# EAGLE design SparkX_EZ_Power_AAA (EAGLE 9.6.2)
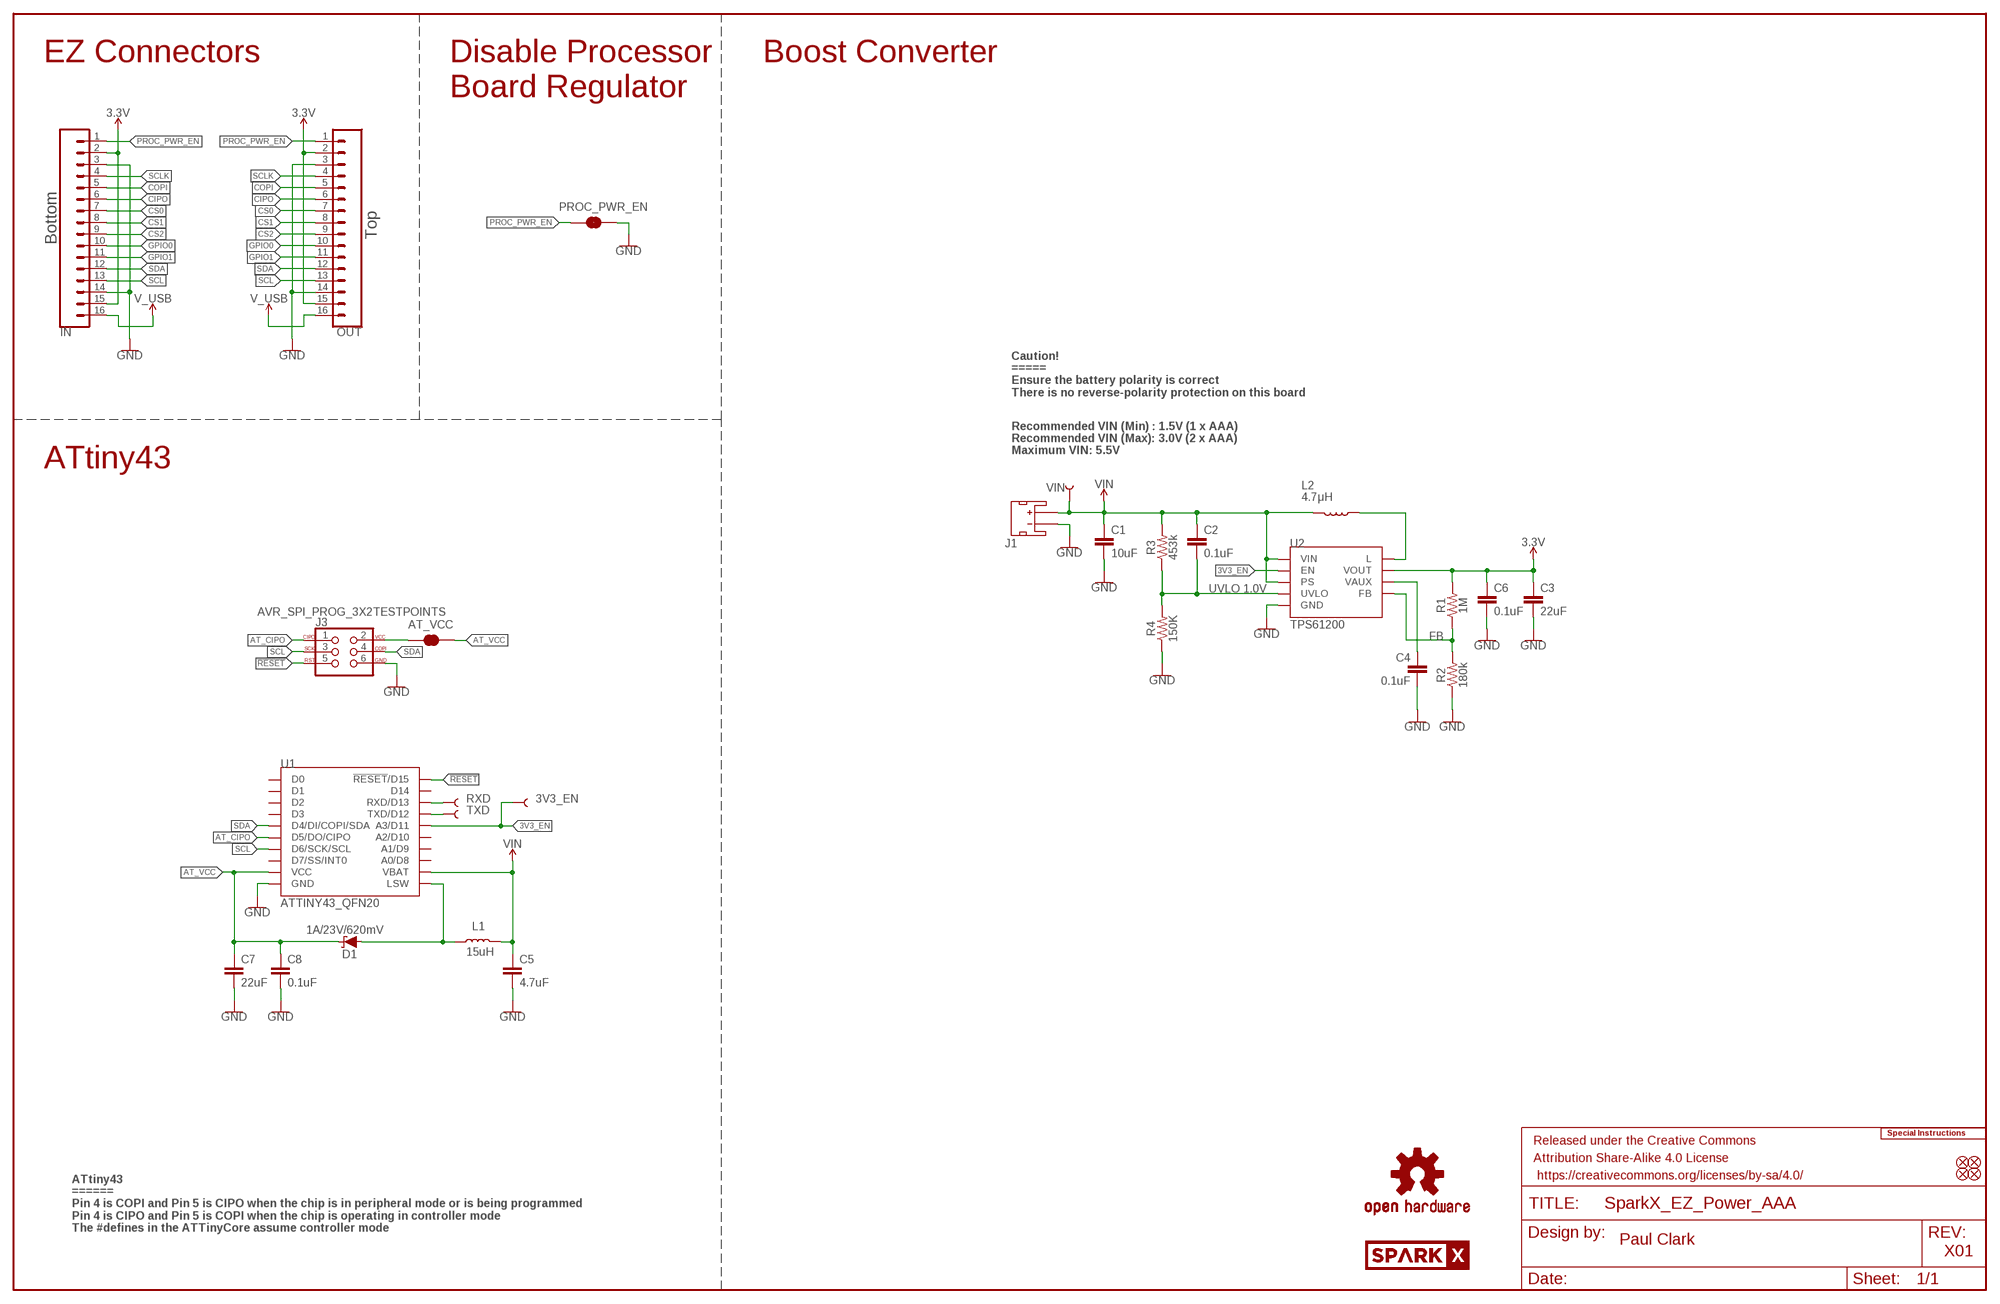
[diagram p0: schematic, sheet 1]

## Parts
3V3_EN  TEST-POINT3X4  [PAD.03X.04]
AT_VCC  JUMPER-SMT_2_NC_TRACE_SILK  [SMT-JUMPER_2_NC_TRACE_SILK]
C1  10uF  10UF-0402T-6.3V-20%  [0402-TIGHT]
C2  0.1uF  0.1UF-0402T-6.3V-10%-X7R  [0402-TIGHT]
C3  22uF  22UF-0603-6.3V-20%  [0603]
C4  0.1uF  0.1UF-0402T-6.3V-10%-X7R  [0402-TIGHT]
C5  4.7uF  4.7UF-0402_TIGHT-6.3V-20%-X5R  [0402-TIGHT]
C6  0.1uF  0.1UF-0402T-6.3V-10%-X7R  [0402-TIGHT]
C7  22uF  22UF-0603-6.3V-20%  [0603]
C8  0.1uF  0.1UF-0402T-6.3V-10%-X7R  [0402-TIGHT]
D1  1A/23V/620mV  DIODE-SCHOTTKY-BAT20J  [SOD-323]
FD1  FIDUCIALUFIDUCIAL  [FIDUCIAL-MICRO]
FD2  FIDUCIALUFIDUCIAL  [FIDUCIAL-MICRO]
FD3  FIDUCIALUFIDUCIAL  [FIDUCIAL-MICRO]
FD4  FIDUCIALUFIDUCIAL  [FIDUCIAL-MICRO]
FRAME1  FRAME-LEDGER  [CREATIVE_COMMONS]
IN  CONN_16FPC_16_0.5MM  [FPC_16_0.5MM]
J1  JST_2MM_MALE  [JST-2-SMD]
J3  AVR_SPI_PROG_3X2TESTPOINTS  [2X3_TEST_POINTS]
L1  15uH  INDUCTOR-LHQ32-15UH  [INDUCTOR_LQH32]
L2  4.7μH  4.7μH_SHIELDED_INDUCTORNPIS_LS  [INDUCTOR_4X4MM]
LOGO1  SPECIAL_INSTRUCTIONS-ORDERING  [ORDERING_INSTRUCTIONS]
LOGO2  OSHW-LOGOMINI  [OSHW-LOGO-MINI]
LOGO3  OSHW-LOGOMINI  [OSHW-LOGO-MINI]
OUT  CONN_16FPC_16_0.5MM  [FPC_16_0.5MM]
PROC_PWR_EN  JUMPER-SMT_2_NC_TRACE_SILK  [SMT-JUMPER_2_NC_TRACE_SILK]
R1  1M  1MOHM-0402T-1/16W-5%  [0402-TIGHT]
R2  180k  180KOHM-0402T-1/16W-1%  [0402-TIGHT]
R3  453k  453KOHM-0402T-1/16W-1%  [0402-TIGHT]
R4  150K  150KOHM-0402T-1/16W-1%  [0402-TIGHT]
RXD  TEST-POINT3X4  [PAD.03X.04]
TXD  TEST-POINT3X4  [PAD.03X.04]
U1  ATTINY43_QFN20  [QFN20_20M1]
U2  TPS61200  TPS61200_MINIMAL  [QFN-10_PAD]
U$1  SPARKX-LOGO3  [SPARKX-SMALL]
VIN  TEST-POINT3X4  [PAD.03X.04]

## Nets
3.3V: C3.1 C6.1 IN.2 IN.15 OUT.2 OUT.15 R1.2 U2.2(VOUT)
3V3_EN: 3V3_EN.1 U1.14(A3/D11) U2.6(EN)
!RESET!: J3.5 U1.18(!RESET!/D15)
AT_CIPO: J3.1 U1.4(D5/DO/CIPO)
AT_VCC: AT_VCC.2 C7.1 C8.1 D1.C U1.7(VCC)
CIPO: IN.6 OUT.6
COPI: IN.5 OUT.5
CS0: IN.7 OUT.7
CS1: IN.8 OUT.8
CS2: IN.9 OUT.9
FB: R1.1 R2.2 U2.10(FB)
GND: C1.2 C3.2 C4.2 C5.2 C6.2 C7.2 C8.2 IN.3 IN.14 J1.1(-) J3.6 OUT.3 OUT.14 PROC_PWR_EN.2 R2.1 R4.1 U1.8(GND) U1.PAD(GND) U2.4(GND) U2.9(GND) U2.11(GND) U2.12(GND) U2.13(GND) U2.14(GND) U2.15(GND)
GPIO0: IN.10 OUT.10
GPIO1: IN.11 OUT.11
N$1: L2.P$1 U2.3(L)
N$2: D1.A L1.P$1 U1.9(LSW)
N$3: AT_VCC.1 J3.2
N$4: C4.1 U2.1(VAUX)
PROC_PWR_EN: IN.1 OUT.1 PROC_PWR_EN.1
RXD: RXD.1 U1.16(RXD/D13)
SCL: IN.13 J3.3 OUT.13 U1.5(D6/SCK/SCL)
SCLK: IN.4 OUT.4
SDA: IN.12 J3.4 OUT.12 U1.3(D4/DI/COPI/SDA)
TXD: TXD.1 U1.15(TXD/D12)
UVLO: C2.2 R3.1 R4.2 U2.7(UVLO)
V_USB: IN.16 OUT.16
VIN: C1.1 C2.1 C5.1 J1.2(+) L1.P$2 L2.P$2 R3.2 U1.10(VBAT) U2.5(VIN) U2.8(PS) VIN.1
Unconnected: J1.NC1(PAD1) J1.NC2(PAD2) U1.1(D2) U1.2(D3) U1.6(D7/SS/INT0) U1.11(A0/D8) U1.12(A1/D9) U1.13(A2/D10) U1.17(D14) U1.19(D0) U1.20(D1)

## Notes on the sheet
- EZ Connectors | Boost Converter
- Disable Processor
  Board Regulator
- Top
- Bottom
- Caution!
  =====
  Ensure the battery polarity is correct
  There is no reverse-polarity protection on this board
- Recommended VIN (Min) : 1.5V (1 x AAA)
  Recommended VIN (Max): 3.0V (2 x AAA)
  Maximum VIN: 5.5V
- ATtiny43
- UVLO 1.0V
- ATtiny43
  ======
  Pin 4 is COPI and Pin 5 is CIPO when the chip is in peripheral mode or is being programmed
  Pin 4 is CIPO and Pin 5 is COPI when the chip is operating in controller mode
  The #defines in the ATTinyCore assume controller mode
- Paul Clark
- X01

## Library data of the parts
3V3_EN RXD TXD VIN = SparkFun-Connectors:TEST-POINT: SparkFun Test Points Bare copper test points for troubleshooting or In-Circuit-Testing. These are used by our Production team for verifying production board runs using pogo-pins on test beds. SparkFun Products: SparkFun LSM9DS1 Breakout <https://www.sparkfun.com/products/13284> SparkFun PSOC <https://www.sparkfun.com/products/13714> SparkFun Load Cell Amplifier <https://www.sparkfun.com/products/13879>
AT_VCC PROC_PWR_EN = SparkFun-Jumpers:JUMPER-SMT_2_NC_TRACE: Normally closed trace jumper This jumper has a trace between two pads so it's normally closed (NC). Use a razor knife to open the connection. For best results follow the IPC guidelines for cutting traces: Cutout at least 0.063 mm (0.005 in). Remove all loose material to clean up the cut area. Seal the cut with an approved epoxy. Reapply solder to reclose the connection.
C1 = SparkFun-Capacitors:10UF: 10.0µF ceramic capacitors A capacitor is a passive two-terminal electrical component used to store electrical energy temporarily in an electric field.; PROD_ID: CAP-14848
C2 C4 C6 C8 = SparkFun-Capacitors:0.1UF: 0.1µF ceramic capacitors A capacitor is a passive two-terminal electrical component used to store electrical energy temporarily in an electric field.; PROD_ID: CAP-14993
C3 C7 = SparkFun-Capacitors:22UF: 22µF ceramic capacitors A capacitor is a passive two-terminal electrical component used to store electrical energy temporarily in an electric field.; PROD_ID: CAP-14464
C5 = SparkFun-Capacitors:4.7UF: 4.7µF ceramic capacitors A capacitor is a passive two-terminal electrical component used to store electrical energy temporarily in an electric field.; PROD_ID: CAP-14240
D1 = SparkFun-DiscreteSemi:DIODE-SCHOTTKY: Schottky diode A Schottky diode is a semiconductor diode which has a low forward voltage drop and a very fast switching action.; PROD_ID: DIO-11623
FD1-FD4 = SparkFun-Aesthetics:FIDUCIAL: Fiducial Alignment Points Point-of-reference for pick-and-place machines and other optical instruments.
FRAME1 = SparkFun-Aesthetics:FRAME-LEDGER: Schematic Frame - Ledger Standard 11x14 US Ledger frame
IN OUT = SparkFun-Connectors:CONN_16: Multi connection point. Often used as Generic Header-pin footprint for 0.1 inch spaced/style header connections On any of the 0.1 inch spaced packages, you can populate with these: Break Away Headers - Straight <https://www.sparkfun.com/products/116> (PRT-00116) Break Away Male Headers - Right Angle <https://www.sparkfun.com/products/553> (PRT-00553) Female Headers <https://www.sparkfun.com/products/115> (PRT-00115) Break Away Headers - Machine Pin <https://www.sparkfun.com/products/117> (PRT-00117) Break Away Female Headers - Swiss Machine Pin <https://www.sparkfun.com/products/743> (PRT-00743) For SCREWTERMINALS and SPRING TERMINALS visit here: Screw Terimnals on SparkFun.com <https://www.sparkfun.com/search/results?term=Screw+Terminals> (5mm/3.5mm/2.54mm spacing) This device is also useful as a general connection point to wire up your design to another part of your project. Our various solder wires solder well into these plated through hole pads. Hook-Up Wire - Assortment (Stranded, 22 AWG) <https://www.sparkfun.com/products/11375> (PRT-11375) Hook-Up Wire - Assortment (Solid Core, 22 AWG) <https://www.sparkfun.com/products/11367> (PRT-11367) View the entire wire category on our website here <https://www.sparkfun.com/categories/141> Special notes: Molex polarized connector foot print use with SKU : PRT-08231 with associated crimp pins and housings. 1MM SMD Version SKU: PRT-10208 NOTES ON THE VARIANTS LOCK and LOCK_LONGPADS... This footprint was designed to help hold the alignment of a through-hole component (i.e. 6-pin header) while soldering it into place. You may notice that each hole has been shifted either up or down by 0.005 of an inch from it's more standard position (which is a perfectly straight line). This slight alteration caused the pins (the squares in the middle) to touch the edges of the holes. Because they are alternating, it causes a "brace" to hold the component in place. 0.005 has proven to be the perfect amount of "off-center" position when using our standard breakaway headers. Although looks a little odd when you look at the bare footprint, once you have a header in there, the alteration is very hard to notice. Also,if you push a header all the way into place, it is covered up entirely on the bottom side.; PROD_ID: CONN-16066
J1 = SparkFun-Connectors:JST_2MM_MALE: JST 2MM MALE RA CONNECTOR Two pin, compact surface mount connector. Commonly used as a battery input connection point. We really like the solid locking feeling and high current rating on these small connectors. We use these all the time as battery connectors. Mates to single-cell LiPo batteries. Here is the connector we sell at SparkFun: JST Right Angle Connector - White <https://www.sparkfun.com/products/8612> (PRT-08612) Datasheet <http://www.sparkfun.com/datasheets/Prototyping/Connectors/JST-Horizontal.pdf> It was used on these SparkFun products: SparkFun MOSFET Power Controller <https://www.sparkfun.com/products/11214> (PRT-11214) SparkFun Battery Babysitter - LiPo Battery Manager <https://www.sparkfun.com/products/13777> (PRT-13777) And many, many others that required a lipo battery connection.; PROD_ID: CONN-11443; SF_ID: PRT-08612
J3 = SparkFun-Connectors:AVR_SPI_PROG_3X2: AVR ISP 6 Pin This is the reduced ISP connector for AVR programming. Common on Arduino. This footprint will take up less PCB space and can be used with a 10-pin to 6-pin adapter such as SKU: BOB-08508 **Special note about "TEST_POINT" package. The stop mask is on the top side, so if you want your programming test points to be on the bottom of your board, make sure to place this package on the bottom side of the board. This also ensure that the orientation to program from the bottom side will be correct. SparkFun Products: SparkFun ISP Pogo Adapter <https://www.sparkfun.com/products/11591> - NS Tiny AVR Programmer <https://www.sparkfun.com/products/11801> -PTH
L1 = SparkFun-Coils:INDUCTOR: Inductors Resist changes in electrical current. Basically a coil of wire. SparkFun Products: SparkFun Load Cell Amplifier - HX711 <https://www.sparkfun.com/products/13879> IOIO-OTG - V2.2 <https://www.sparkfun.com/products/13613>; PROD_ID: NDUC-14107
L2 = SparkFun-Coils:4.7μH_SHIELDED_INDUCTOR: 4.7uH Inductor 4.7uH 1.4A 50mOhm 1008(2520) Package Shielded; PROD_ID: NDUC-15245
LOGO1 = SparkFun-Aesthetics:SPECIAL_INSTRUCTIONS: Special Ordering/Production Instructions Alert Symbol for special PCB ordering instructions or unique production process warnings. Ordering Instructions Production Instructions Types of information that should be added to box: Copper weight Soldermask color Silk color PCB thickness Number of layers PCB Standard: 1.6mm FR4 1 oz copper immersion silver plating red soldermask white silkscreen Types of information that should be added to box: Special wash requirements Depaneling instructions Humidification Glue curing Default text settings: 0.07 inch 9% ratio 50% line distance
LOGO2 LOGO3 = SparkFun-Aesthetics:OSHW-LOGO: Open-Source Hardware (OSHW) Logo This logo indicates the piece of hardware it is found on incorporates a OSHW license and/or adheres to the definition of open source hardware found here: http://freedomdefined.org/OSHW
R1 = SparkFun-Resistors:1MOHM: 1MΩ resistor A resistor is a passive two-terminal electrical component that implements electrical resistance as a circuit element. Resistors act to reduce current flow, and, at the same time, act to lower voltage levels within circuits. - Wikipedia; PROD_ID: RES-15185
R2 = SparkFun-Resistors:180KOHM: 180kΩ resistor A resistor is a passive two-terminal electrical component that implements electrical resistance as a circuit element. Resistors act to reduce current flow, and, at the same time, act to lower voltage levels within circuits. - Wikipedia; PROD_ID: RES-16069
R3 = SparkFun-Resistors:453KOHM: 453kΩ resistor A resistor is a passive two-terminal electrical component that implements electrical resistance as a circuit element. Resistors act to reduce current flow, and, at the same time, act to lower voltage levels within circuits. - Wikipedia; PROD_ID: RES-15345
R4 = SparkFun-Resistors:150KOHM: 150kΩ resistor A resistor is a passive two-terminal electrical component that implements electrical resistance as a circuit element. Resistors act to reduce current flow, and, at the same time, act to lower voltage levels within circuits. - Wikipedia; PROD_ID: RES-15093
U1 = SparkFun-IC-Microcontroller:ATTINY43: ATtiny43 Pin 4 is COPI and Pin 5 is CIPO when the chip is in peripheral mode or is being programmed Pin 4 is CIPO and Pin 5 is COPI when the chip is operating in controller mode The #defines in the ATTinyCore assume controller mode; DIGIKEY_PART: ATTINY43U-MU-ND; MANU_PART: ATtiny43U-MU; PROD_ID: IC-16068
U2 = SparkFun-IC-Power:TPS61200_MINIMAL: DC to DC Booster IC-10035; PROD_ID: IC-10035
U$1 = SparkX:SPARKX-LOGO

## Net classes
1 Power: width 0.305 mm
2 3.3V: width 0.508 mm

## Board
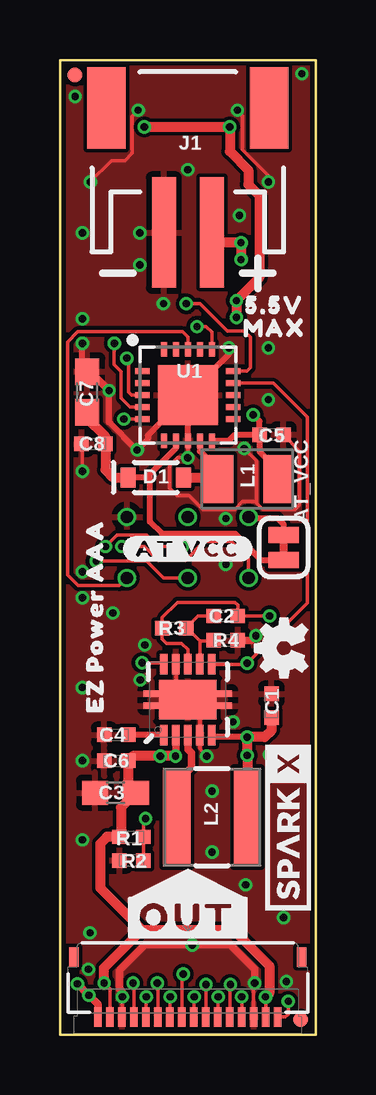
[diagram p1: board, top side]
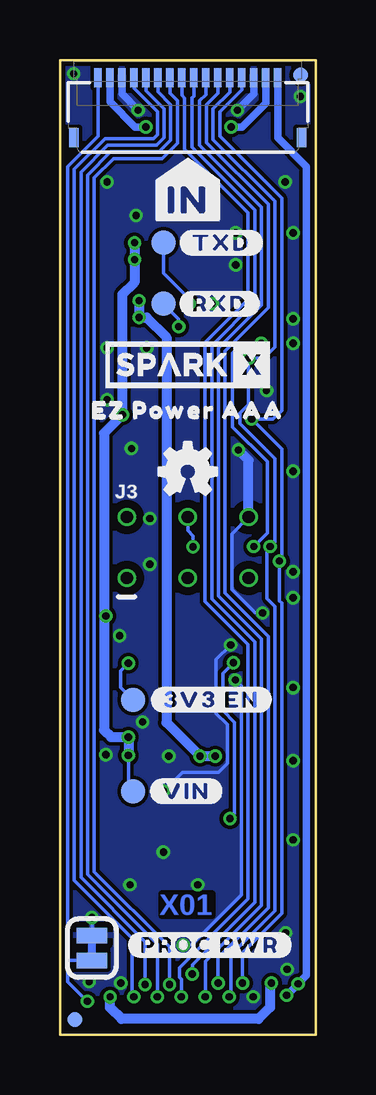
[diagram p2: board, bottom side, seen from below]

Size 10.67 x 40.64 mm. Coordinates in mm from the lower left corner, seen from the top.
Outline: 0,40.64 0,0 10.67,0 10.67,40.64 0,40.64
Copper layers (1*16): Top 0.035mm / dielectric 1.5mm / Bottom 0.035mm
Design rules "SparkFun-2-Layer-Minimum-JLCPCB": minimum track width 5mil, minimum drill 0.3mm, track to track 5mil, track to pad 5mil, pad to pad 5mil, via to via 5mil, smd to smd 5mil, copper to edge 7mil, drill to drill 7mil, minimum pad ring 5mil, minimum via ring 5mil, stop-mask expansion 2.5mil, vias tented up to drill 25mil, thermal gap 10mil
bRestrict: area 2.3,21.1 to 3.3,22.1; area 4.8,21.1 to 5.8,22.1; area 7.4,21.1 to 8.4,22.1; area 7.4,18.5 to 8.4,19.6; area 4.8,18.5 to 5.8,19.6; area 2.3,18.5 to 3.3,19.6

### Footprints (pad centres in the part's own frame; a part is rotated, then mirrored left to right if it is on the bottom)
PAD.03X.04 = smd 1.016 x 1.016: 1 0,0
SMT-JUMPER_2_NC_TRACE_SILK = smd 0.66 x 1.27: 1 -0.521,0; 2 0.521,0
0402-TIGHT = smd 0.6 x 0.6: 1 -0.5,0; 2 0.5,0
0603 = smd 1.1 x 1: 1 -0.85,0; 2 0.85,0
SOD-323 = smd 0.63 x 0.83: A 1.15,0; C -1.15,0
FIDUCIAL-MICRO = smd 0.635 x 0.635: 1 0,0
FPC_16_0.5MM = smd 0.3 x 0.8: 1 -3.75,1.35; 2 -3.25,1.35; 3 -2.75,1.35; 4 -2.25,1.35; 5 -1.75,1.35; 6 -1.25,1.35; 7 -0.75,1.35; 8 -0.25,1.35; 9 0.25,1.35; 10 0.75,1.35; 11 1.25,1.35; 12 1.75,1.35; 13 2.25,1.35; 14 2.75,1.35; 15 3.25,1.35; 16 3.75,1.35 | smd 0.4 x 0.8: MP1 -4.75,-1.15; MP2 4.75,-1.15
JST-2-SMD = smd 1 x 4.6: 1 -1,-3.7; 2 1,-3.7 | smd 1.6 x 3.4: NC1 -3.4,1.5; NC2 3.4,1.5
2X3_TEST_POINTS = drill 0.508: 1 -2.54,-1.27; 2 -2.54,1.27; 3 0,-1.27; 4 0,1.27; 5 2.54,-1.27; 6 2.54,1.27
INDUCTOR_LQH32 = smd 2 x 1.25: P$1 -0.07,1.205; P$2 -0.07,-1.295
INDUCTOR_4X4MM = smd 4.089 x 1.143: P$1 0,1.473; P$2 0,-1.473
QFN20_20M1 = smd 0.6 x 0.25: 1 -1.9,1; 2 -1.9,0.5; 3 -1.9,0; 4 -1.9,-0.5; 5 -1.9,-1; 11 1.9,-1; 12 1.9,-0.5; 13 1.9,0; 14 1.9,0.5; 15 1.9,1 | smd 0.25 x 0.6: 6 -1,-1.9; 7 -0.5,-1.9; 8 0,-1.9; 9 0.5,-1.9; 10 1,-1.9; 16 1,1.9; 17 0.5,1.9; 18 0,1.9; 19 -0.5,1.9; 20 -1,1.9 | smd 2.5 x 2.5: PAD 0,0
QFN-10_PAD = smd 0.297 x 0.85: 1 -1,-1.475; 2 -0.5,-1.475; 3 0,-1.475; 4 0.5,-1.475; 5 1,-1.475; 6 1,1.475; 7 0.5,1.475; 8 0,1.475; 9 -0.5,1.475; 10 -1,1.475 | smd 0.7 x 0.28: 11 -1.5,0.25; 12 -1.5,-0.25; 13 1.5,0.25; 14 1.5,-0.25 | smd 2.4 x 1.65: 15 0,0

### Placement (x,y rotation side)
3V3_EN  7.62,13.97 0 bottom
AT_VCC  9.33,20.32 270 top
C1  8.83,13.72 90 top
C2  6.92,17.46 180 top
C3  2.32,10.1 180 top
C4  2.35,12.51 180 top
C5  8.83,25.02 0 top
C6  2.35,11.43 180 top
C7  1.14,26.8 90 top
C8  1.4,24.64 180 top
D1  4,23.24 0 top
FD1  0.64,40.01 0 top
FD2  0.64,40.01 0 bottom
FD3  10.03,0.64 0 top
FD4  10.03,0.64 0 bottom
FRAME1  45.72,-10.16 0 top  (outside the outline)
IN  5.33,38.54 0 bottom
J1  5.33,37.15 0 top
J3  5.33,20.32 0 bottom
L1  7.81,23.24 90 top
L2  6.35,9.08 90 top
LOGO1  19.05,50.8 0 top  (outside the outline)
LOGO2  9.33,16.13 90 top
LOGO3  5.33,23.5 0 bottom
OUT  5.33,2.1 180 top
PROC_PWR_EN  9.33,3.62 90 bottom
R1  2.98,8.26 180 top
R2  2.98,7.27 0 top
R3  4.76,16.95 180 top
R4  6.92,16.45 180 top
RXD  6.35,30.48 0 bottom
TXD  6.35,33.02 0 bottom
U1  5.33,26.67 0 top
U2  5.33,13.97 0 top
U$1  9.53,8.64 90 top
U$2  [EZ_POWER_AAA0]  1.46,17.46 90 top
U$3  [EZ_POWER_AAA0]  5.33,26.04 0 bottom
U$4  [#TXD#0]  3.94,33.02 0 bottom
U$5  [#VIN#0]  5.4,10.16 0 bottom
U$6  [#3V3_EN#0]  4.35,13.97 0 bottom
U$7  [#PROC_PWR#0]  4.41,3.75 0 bottom
U$8  [#AT_VCC#0]  5.33,20.26 0 top
U$9  [#RXD#0]  4,30.48 0 bottom
U$10  [5#5V0]  8.95,30.42 0 top
U$11  [MAX0]  8.95,29.46 0 top
U$12  [#IN#0]  5.33,34.8 0 bottom
U$13  [#OUT#0]  5.33,4.89 0 top
U$20  SPARKX-LOGO3  [SPARKX-SMALL]  5.33,27.94 0 bottom
VIN  7.62,10.16 0 bottom

### Tracks (layer width: path | path; a pad name or v marks a point on that pad's centre or on a via)
3.3V  (via drill 0.3)
  Top 0.152: OUT.2 v8.58,1.58 | OUT.15 2.08,1.92 v1.84,2.16
  Top 0.305: v4.83,11.62 v4.83,11.63 U2.2
  Top 0.406: v1.84,2.16 1.84,2.79 3.43,4.38 | 3.43,4.38 7.24,4.38 8.73,2.88 8.73,1.73 v8.58,1.58 | v3.52,37.85 v7.08,37.85 7.08,36.83 7.86,36.05 7.86,35.45 8.32,34.99 8.32,31.56 v7.37,30.61 v7.37,29.91 | v4.83,11.62 v4.19,11.62 3.04,11.62 C6.1 2.85,10.41 C3.1 2.55,9.48 2.55,8.32 R1.2 1.97,8.26 1.68,7.97 1.68,6.13 3.43,4.38
  Bottom 0.305: IN.15 2.08,38.84 3.08,37.85 v3.52,37.85 | v7.08,37.85 7.53,37.85 8.58,38.9 IN.2
  Bottom 0.406: v1.84,2.16 1.91,2.1 1.91,1.14 2.38,0.66 8.1,0.66 8.58,1.14 v8.58,1.58 | v7.37,30.61 v7.37,29.91 7.05,29.91 6.22,29.08 6.22,13.02 v4.83,11.62 v4.19,11.62
3V3_EN  (via drill 0.3)
  Top 0.152: U1.14 8.9,27.17 10.31,25.75 10.31,18 v7.81,15.49 7.76,15.45 U2.6
  Bottom 0.152: v7.81,15.49 8.13,15.18 8.13,14.48 3V3_EN.1
!RESET!
  Top 0.152: U1.18 5.33,29.08 5.11,29.31 0.74,29.31 0.32,28.89 0.32,19.18 0.76,18.73 2.48,18.73 J3.5
AT_CIPO  (via drill 0.3)
  Top 0.152: v2.27,28.83 2.27,27.94 2.56,27.65 2.56,26.54 2.93,26.17 U1.4 | v2.58,20.36 3.53,20.36 4.1,19.78 5.24,19.78 6.02,20.56 7.17,20.56 7.87,19.85 J3.1
  Bottom 0.152: v2.27,28.83 3.06,28.83 3.46,28.43 3.46,25.35 2.01,23.89 2.01,20.92 v2.58,20.36
AT_VCC
  Top 0.254: U1.7 4.83,24.46 3.62,23.24 | 3.62,23.24 3.75,23.24 3.75,21.4 4.25,20.89 7.3,20.89 8.39,19.8 AT_VCC.2 | 3.62,23.24 D1.C
  Top 0.406: C7.1 1.14,25.69 1.9,24.94 C8.1 1.9,23.57 2.22,23.24 D1.C
CIPO  (via drill 0.3)
  Top 0.152: OUT.6 6.58,1.57 v6.6,1.59
  Bottom 0.152: IN.6 6.58,39.32 6.05,38.78 6.05,37.29 6.53,36.81 8.55,36.81 9.51,35.85 9.51,6.68 6.6,3.77 v6.6,1.59
COPI  (via drill 0.3)
  Top 0.152: OUT.5 7.08,2.07 v7.11,2.1
  Bottom 0.152: IN.5 7.08,39.36 6.33,38.6 6.33,37.4 6.64,37.09 8.67,37.09 9.79,35.96 9.79,6.57 7.11,3.89 v7.11,2.1
CS0  (via drill 0.3)
  Top 0.152: OUT.7 6.08,2.08 v6.1,2.1
  Bottom 0.152: IN.7 6.08,39.26 5.77,38.94 5.77,37.17 6.41,36.53 8.44,36.53 9.23,35.73 9.23,6.8 6.1,3.66 v6.1,2.1
CS1  (via drill 0.3)
  Top 0.152: OUT.8 5.58,1.57 v5.6,1.59
  Bottom 0.152: IN.8 5.58,39.16 5.46,39.04 5.46,36.92 2.81,34.27 2.81,30.66 4.61,28.86 4.61,18.07 2.81,16.27 2.81,5.67 5.69,2.8 5.69,2.4 5.6,2.32 v5.6,1.59
CS2  (via drill 0.3)
  Top 0.152: OUT.9 5.08,2.48 v5.14,2.54
  Bottom 0.152: v5.14,2.54 5.14,2.91 2.54,5.52 2.54,16.38 4.33,18.18 4.33,28.74 2.54,30.54 2.54,34.39 5.15,37 5.15,39.07 5.08,39.13 IN.9
FB  (via drill 0.3)
  Top 0.152: v3.43,15.51 4.27,15.51 U2.10 | R2.2 R1.1 3.48,8.93 v3.57,9.02
  Bottom 0.152: v3.43,15.51 3.87,15.07 3.87,13.53 3.38,13.03 3.38,9.21 v3.57,9.02
GND  (via drill 0.3)
  Top 0.152: v8.13,2.16 8.06,2.1 8.06,0.77 OUT.3 | OUT.14 2.58,1.57 v2.6,1.59 | C8.2 0.94,24.6 v0.94,23.5 | U1.8 v5.33,24.06 4.91,24.06 4.57,23.73 4.57,22.8 4.89,22.48 5.38,22.48 5.96,21.9 7.3,21.9 7.62,22.23 8.19,22.23 | v3.27,38.54 3.02,38.3 3.02,36.75 2.71,36.44 2.15,36.44 v1.27,35.56 | v7.4,38.54 7.62,38.33 7.62,36.9 8.7,35.82 v8.7,35.56 | v7.68,24.45 8.19,23.94 8.19,22.23 | C5.2 10,24.35 10,22.09 9.81,21.9 8.46,21.9 8.19,22.17 8.19,22.23 | U2.9 4.83,14.47 U2.15 5.83,13.47 U2.4 5.83,11.91 v6.13,11.62
  Top 0.254: U1.8 U1.PAD | v7.05,28.64 7.05,28.38 U1.PAD | C7.2 0.94,27.85 v0.94,28.83 | v2.05,26.86 2.05,25.54 3.2,24.38 v3.22,24.38 3.67,24.83 3.67,25 U1.PAD | U2.13 5.58,14.22 U2.15
  Top 0.305: v2.6,1.59 2.6,1.82 2.49,1.93 2.49,2.68 3.56,3.75 v5.52,3.75 7.11,3.75 8.13,2.73 v8.13,2.16 | C7.2 1.26,27.65 v2.05,26.86 | R4.1 7.99,16.45 v8.18,16.64
  Bottom 0.152: PROC_PWR_EN.2 v9.34,4.89 | v2.21,17.59 2.52,17.59 3.5,18.57 3.5,20.89 J3.6 | v3.35,14.8 3.09,14.54 3.09,5.83 5.17,3.75 v5.52,3.75 | v6.35,10.16 5.56,10.95 4.06,10.95 3.68,11.32 3.68,12.94 4.15,13.41 4.15,15.64 v3.54,16.26
  Bottom 0.305: IN.14 2.58,39.23 v3.27,38.54 | IN.3 8.08,39.23 v7.4,38.54
  Bottom 0.406: J3.6 2.79,23.95 v3.22,24.38
  other vias: 3.33,33.43 0.94,29.84 8.7,28.64 8.7,26.48 0.94,19.3 0.94,18.22 1.25,4.25 1.19,2.73 10.1,40.07 0.64,39.12 9.45,2.22 3.33,32.1 5.33,36.07 0.94,8.13 0.94,11.43 0.94,14.48 7.22,13.05 4.32,30.48 8.75,11.68 4.92,6.25 6.35,7.62 6.92,21.53 6.92,19.62 7.75,6.25 0.94,33.43 7.49,34.16
  pour Top (isolate 0.152, rank 3): 0,40.64 10.67,40.64 10.67,0 0,0
  pour Bottom (isolate 0.152, rank 2): 0,40.64 10.67,40.64 10.67,0 0,0
GPIO0  (via drill 0.3)
  Top 0.152: OUT.10 4.58,1.57 v4.6,1.59
  Bottom 0.152: IN.10 4.58,39.2 4.84,38.94 4.84,37.09 2.26,34.51 2.26,30.43 4.05,28.63 4.05,18.3 2.26,16.5 2.26,5.41 4.6,3.06 v4.6,1.59
GPIO1  (via drill 0.3)
  Top 0.152: OUT.11 4.08,2.14 v4.06,2.16
  Bottom 0.152: IN.11 4.08,39.26 4.56,38.78 4.56,37.2 1.98,34.62 1.98,30.31 3.78,28.51 3.78,18.41 1.98,16.61 1.98,5.29 4.06,3.2 v4.06,2.16
N$1
  Top 0.305: U2.3 5.33,11.91 5.49,11.75 5.49,11.14 5.17,10.83 5.14,10.83 4.88,10.56 L2.P$1
N$2
  Top 0.254: U1.9 5.83,24.33 6.61,23.56 L1.P$1
  Top 0.406: D1.A 6.54,23.24 L1.P$1
N$3
  Top 0.254: AT_VCC.1 9.34,21.29 9.09,21.53 7.94,21.53 J3.2
N$4
  Top 0.254: U2.1 2.86,12.49 C4.1
PROC_PWR_EN  (via drill 0.3)
  Top 0.152: v9.53,1.4 9.53,0.87 9.4,0.75 OUT.1
  Bottom 0.152: 10.35,3.11 10.35,36.2 9.08,37.46 IN.1 | PROC_PWR_EN.1 10.34,3.1 10.35,3.11 | v9.53,1.4 10.35,2.22 10.35,3.11
RXD  (via drill 0.3)
  Top 0.152: U1.16 6.33,29.29 6.1,29.53 v5.71,29.53
  Bottom 0.152: RXD.1 5.71,29.84 v5.71,29.53
SCL  (via drill 0.3)
  Top 0.152: OUT.13 3.08,2.12 v3.05,2.16 | v2.67,25.67 U1.5 | J3.3 4.32,19.05 3.62,19.75 v1.51,19.75
  Bottom 0.152: IN.13 3.08,39.41 4,38.49 4,37.46 2.41,35.88 1.42,34.89 1.42,26.03 1.78,25.67 v2.67,25.67 1.42,24.42 1.42,19.84 v1.51,19.75 1.51,18.1 1.42,18.01 1.42,5.06 3.05,3.43 v3.05,2.16
SCLK  (via drill 0.3)
  Top 0.152: OUT.4 v7.58,1.59 | v7.58,1.59
  Bottom 0.152: IN.4 7.58,39.47 6.61,38.49 6.61,37.52 6.76,37.37 8.79,37.37 10.07,36.08 10.07,6.45 7.65,4.03 7.65,1.65 v7.58,1.59
SDA  (via drill 0.3)
  Top 0.152: OUT.12 3.58,1.57 v3.6,1.59 | v2.79,28.21 2.86,28.14 2.86,26.8 2.99,26.67 U1.3 | v1.9,20.36 2.38,20.84 3.61,20.84 4.1,20.35 v5.11,20.35
  Bottom 0.152: IN.12 3.58,39.3 4.28,38.6 4.28,37.33 1.7,34.74 1.7,28.67 2.16,28.21 v2.79,28.21 2.79,26.29 3.16,25.92 3.16,25.49 1.7,24.02 1.7,20.56 v1.9,20.36 2.02,20.23 2.02,18.2 1.7,17.87 1.7,5.17 3.54,3.33 3.54,1.65 v3.6,1.59 | J3.4 5.33,21.02 5.11,20.8 v5.11,20.35
TXD  (via drill 0.3)
  Top 0.152: U1.15 7.79,27.67 7.94,27.81 7.94,29.08 7.68,29.34 6.99,29.34 5.84,30.48 v5.27,30.48
  Bottom 0.152: v5.27,30.48 5.27,30.67 6.35,31.75 TXD.1
UVLO
  Top 0.152: R4.2 6.39,16.42 5.83,16.42 | U2.7 5.83,16.42 | 5.83,16.42 5.29,16.95 R3.1 5.77,17.46 C2.2
V_USB  (via drill 0.3)
  Top 0.305: OUT.16 1.58,1.27 v1.21,1.65 v0.73,2.13
  Bottom 0.305: IN.16 1.58,37.4 0.38,36.2 0.38,2.48 v0.73,2.13 v1.21,1.65
VIN  (via drill 0.3)
  Top 0.152: U2.8 5.33,16.07 5.08,16.32 4.45,16.32 4.25,16.51 R3.2 4.26,17.4 4.9,18.03 7.3,18.03 7.42,17.91 C2.1 v8.75,17.46
  Top 0.254: U1.10 7.05,24.77 7.3,25.02 C5.1 | C5.1 8.33,24.31 9.11,23.53 L1.P$2 | C5.1 8.33,25.58 v8.06,25.84 | v7.81,12.41 7.78,12.45 6.38,12.45 U2.5
  Top 0.406: v7.56,32.32 v7.56,33.02 6.76,33.02 J1.2 | C1.1 8.83,12.7 8.54,12.41 v7.81,12.41 v7.81,11.65 7.82,11.64 L2.P$2
  Bottom 0.152: VIN.1 7.81,10.35 v7.81,11.65
  Bottom 0.406: v7.56,33.02 v7.56,32.32 7.56,31.37 8.06,30.86 v8.06,25.84 8.83,25.08 8.83,17.46 | 8.83,17.46 8.83,12.7 8.54,12.41 v7.81,12.41 v7.81,11.65 | v8.75,17.46 8.83,17.46

### Text on the board
Bottom: X01
Measures: Dimensions in Inches
tDocu: 2-Layer Board / 1.6mm Thickness / 1oz Copper (Outer layers) / HASL Finish | Paul Clark